# Altium schematic sheet Sheet1.SchDoc
size A4
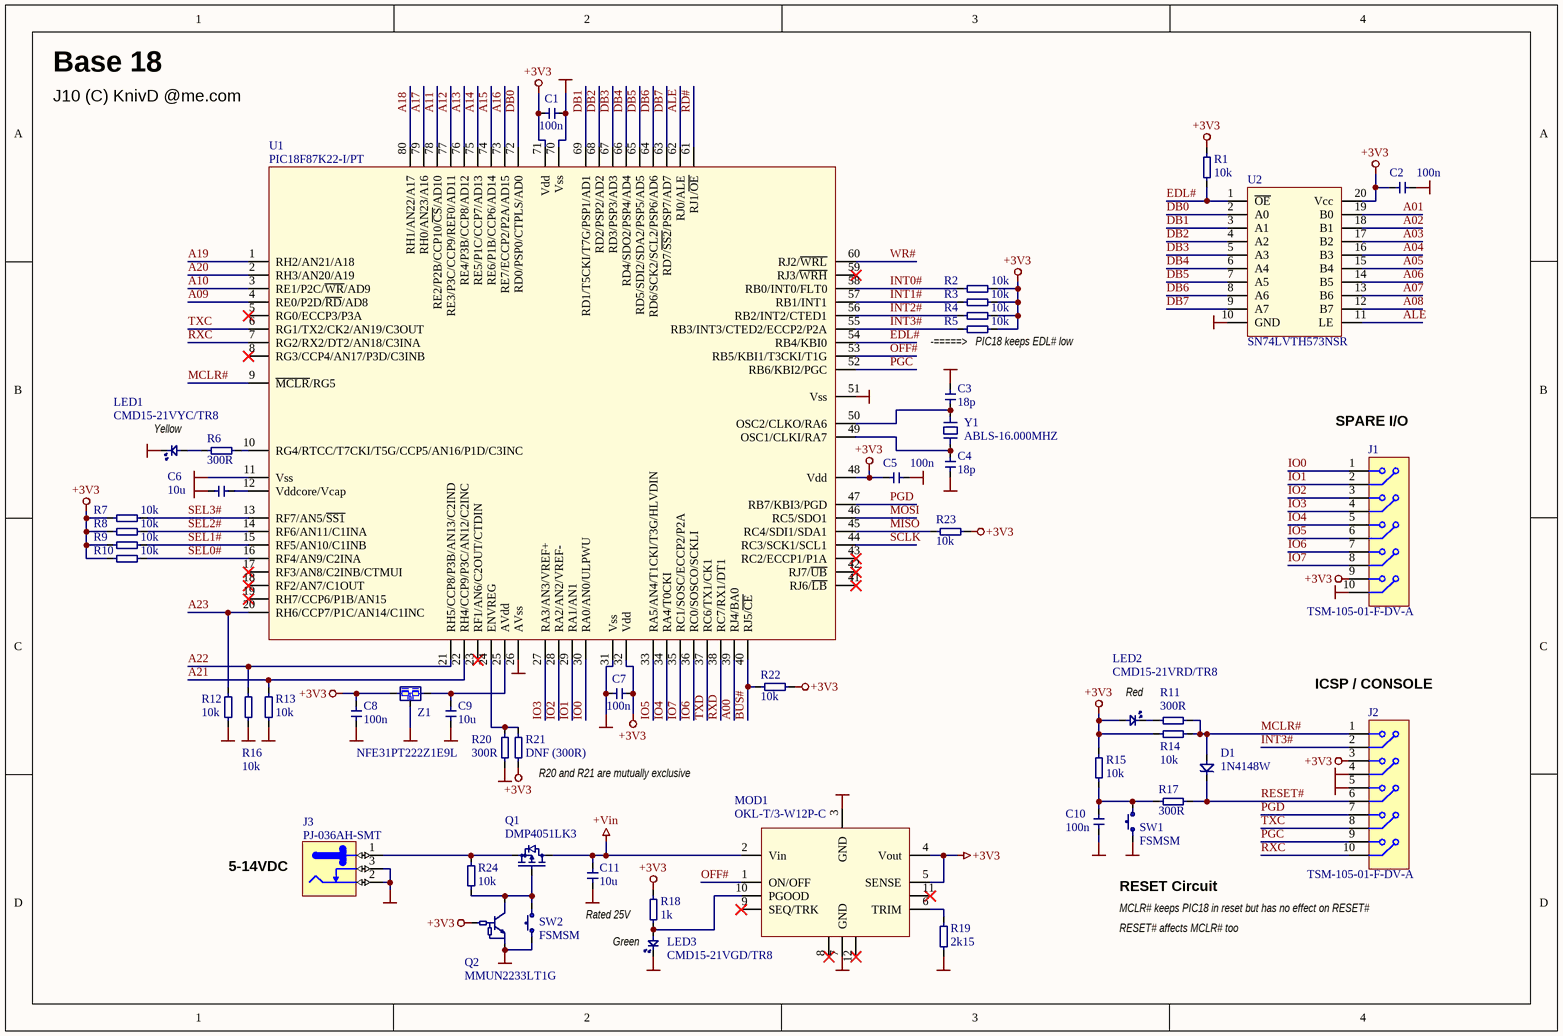
[diagram p0: Sheet1.SchDoc]

## Parts
C1  100n  [CAPC3216X110N]
C2  100n  [CAPC3216X110N]
C3  18p  [CAPC3216X110N]
C4  18p  [CAPC3216X110N]
C5  100n  [CAPC3216X110N]
C6  10u  [CAPC3216X110N]
C7  100n  [CAPC3216X110N]
C8  100n  [CAPC3216X110N]
C9  10u  [CAPC3216X110N]
C10  100n  [CAPC3216X110N]
C11  Note: 10u  [CAPC3216X110N]  (hidden comment: 10u/25V)
D1  1N4148W  [SOD-123]
J1  TSM-105-01-F-DV-A  [2015-2X05XD]
J2  TSM-105-01-F-DV-A  [2015-2X05XD]
J3  PJ-036AH-SMT  [PJ-036AH-SMT]
LED1  CMD15-21VYC/TR8  [LED_OSRAM_LYN971]
LED2  CMD15-21VRD/TR8  [LED_OSRAM_LHN974]
LED3  CMD15-21VGD/TR8  [LED_OSRAM_LGN971]
MOD1  OKL-T/3-W12P-C  [OKL-T/3-W12]
Q1  DMP4051LK3  [TO228P991X239-3N-R546X521]
Q2  MMUN2233LT1G  [SOT23-3]
R1  10k  [RESC3216X75N]
R2  10k  [RESC3216X75N]
R3  10k  [RESC3216X75N]
R4  10k  [RESC3216X75N]
R5  10k  [RESC3216X75N]
R6  300R  [RESC3216X75N]
R7  10k  [RESC3216X75N]
R8  10k  [RESC3216X75N]
R9  10k  [RESC3216X75N]
R10  10k  [RESC3216X75N]
R11  300R  [RESC3216X75N]
R12  10k  [RESC3216X75N]
R13  10k  [RESC3216X75N]
R14  10k  [RESC3216X75N]
R15  10k  [RESC3216X75N]
R16  10k  [RESC3216X75N]
R17  300R  [RESC3216X75N]
R18  1k  [RESC3216X75N]
R19  2k15  [RESC3216X75N]
R20  300R  [RESC3216X75N]
R21  DNF (300R)  [RESC3216X75N]
R22  10k  [RESC3216X75N]
R23  10k  [RESC3216X75N]
R24  10k  [RESC3216X75N]
SW1  FSMSM  [PB_TYCO_FSMSM]
SW2  FSMSM  [PB_TYCO_FSMSM]
U1  PIC18F87K22-I/PT  [QFP50P1400X1400X120-80N]
U2  SN74LVTH573NSR  [SOIC127P780X200-20N]
Y1  ABLS-16.000MHZ  [XTAL1140X470X160N]
Z1  NFE31PT222Z1E9L  [NFE31xx]

## Nets
+3V3: C1.1 C2.1 C5.1 C7.1 C8.1 J1.9 J2.3 LED2.2 MOD1.4(Vout) MOD1.5(SENSE) Q2.1(B) R1.2 R2.1 R3.1 R4.1 R5.1 R7.1 R8.1 R9.1 R10.1 R14.2 R15.2 R18.1 R21.2 R22.1 R23.1 U1.32(Vdd) U1.48(Vdd) U1.71(Vdd) U2.20(Vcc) Z1.1
+Vin: C11.1 MOD1.2(Vin) Q1.3(D)
GND: C1.2 C2.2 C3.2 C4.1 C5.2 C6.2 C7.2 C8.2 C9.2 C10.1 C11.2 J1.10 J2.4 J2.5 J3.2 J3.3 LED1.1 LED3.1 MOD1.3(GND) MOD1.7(GND) Q2.2(E) R12.2 R13.2 R16.2 R19.1 R20.2 SW1.1 SW2.1 U1.11(Vss) U1.26(AVss) U1.31(Vss) U1.51(Vss) U1.70(Vss) U2.10(GND) Z1.2
A00: U1.39(RJ4/BA0)
A01: U2.19(B0)
A02: U2.18(B1)
A03: U2.17(B2)
A04: U2.16(B3)
A05: U2.15(B4)
A06: U2.14(B5)
A07: U2.13(B6)
A08: U2.12(B7)
A09: U1.4(RE0/P2D/~{RD}/AD8)
A10: U1.3(RE1/P2C/~{WR}/AD9)
A11: U1.78(RE2/P2B/CCP10/~{CS}/AD10)
A12: U1.77(RE3/P3C/CCP9/REF0/AD11)
A13: U1.76(RE4/P3B/CCP8/AD12)
A14: U1.75(RE5/P1C/CCP7/AD13)
A15: U1.74(RE6/P1B/CCP6/AD14)
A16: U1.73(RE7/ECCP2/P2A/AD15)
A17: U1.79(RH0/AN23/A16)
A18: U1.80(RH1/AN22/A17)
A19: U1.1(RH2/AN21/A18)
A20: U1.2(RH3/AN20/A19)
A21: R13.1 U1.22(RH4/CCP9/P3C/AN12/C2INC)
A22: R16.1 U1.21(RH5/CCP8/P3B/AN13/C2IND)
A23: R12.1 U1.20(RH6/CCP7/P1C/AN14/C1INC)
ALE: U1.62(RJ0/ALE) U2.11(LE)
BUS#: R22.2 U1.40(RJ5/~{CE})
DB0: U1.72(RD0/PSP0/CTPLS/AD0) U2.2(A0)
DB1: U1.69(RD1/T5CKI/T7G/PSP1/AD1) U2.3(A1)
DB2: U1.68(RD2/PSP2/AD2) U2.4(A2)
DB3: U1.67(RD3/PSP3/AD3) U2.5(A3)
DB4: U1.66(RD4/SDO2/PSP4/AD4) U2.6(A4)
DB5: U1.65(RD5/SDI2/SDA2/PSP5/AD5) U2.7(A5)
DB6: U1.64(RD6/SCK2/SCL2/PSP6/AD6) U2.8(A6)
DB7: U1.63(RD7/~{SS2}/PSP7/AD7) U2.9(A7)
EDL#: R1.1 U1.54(RB4/KBI0) U2.1(~{OE})
INT0#: R2.2 U1.58(RB0/INT0/FLT0)
INT1#: R3.2 U1.57(RB1/INT1)
INT2#: R4.2 U1.56(RB2/INT2/CTED1)
INT3#: J2.2 R5.2 U1.55(RB3/INT3/CTED2/ECCP2/P2A)
IO0: J1.1 U1.30(RA0/AN0/ULPWU)
IO1: J1.2 U1.29(RA1/AN1)
IO2: J1.3 U1.28(RA2/AN2/VREF-)
IO3: J1.4 U1.27(RA3/AN3/VREF+)
IO4: J1.5 U1.34(RA4/T0CKI)
IO5: J1.6 U1.33(RA5/AN4/T1CKI/T3G/HLVDIN)
IO6: J1.7 U1.36(RC0/SOSCO/SCKLI)
IO7: J1.8 U1.35(RC1/SOSC/ECCP2/P2A)
MCLR#: D1.2 J2.1 R11.1 R14.1 U1.9(~{MCLR}/RG5)
MISO: R23.2 U1.45(RC4/SDI1/SDA1)
MOSI: U1.46(RC5/SDO1)
OFF#: MOD1.1(ON/OFF) U1.53(RB5/KBI1/T3CKI/T1G)
PGC: J2.9 U1.52(RB6/KBI2/PGC)
PGD: J2.7 U1.47(RB7/KBI3/PGD)
RD#: U1.61(RJ1/~{OE})
RESET#: D1.1 J2.6 R17.2
RXC: J2.10 U1.7(RG2/RX2/DT2/AN18/C3INA)
RXD: U1.38(RC7/RX1/DT1)
SCLK: U1.44(RC3/SCK1/SCL1)
SEL0#: R10.2 U1.16(RF4/AN9/C2INA)
SEL1#: R9.2 U1.15(RF5/AN10/C1INB)
SEL2#: R8.2 U1.14(RF6/AN11/C1INA)
SEL3#: R7.2 U1.13(RF7/AN5/~{SS1})
TXC: J2.8 U1.6(RG1/TX2/CK2/AN19/C3OUT)
TXD: U1.37(RC6/TX1/CK1)
WR#: U1.60(RJ2/~{WRL})
NetC3_1: C3.1 U1.50(OSC2/CLKO/RA6) Y1.2
NetC4_2: C4.2 U1.49(OSC1/CLKI/RA7) Y1.1
NetC6_1: C6.1 U1.12(Vddcore/Vcap)
NetC9_1: C9.1 U1.25(AVdd) Z1.3
NetC10_2: C10.2 R15.1 R17.1 SW1.2
NetJ3_1: J3.1 Q1.2(S) R24.2
NetLED1_2: LED1.2 R6.1
NetLED2_1: LED2.1 R11.2
NetLED3_2: LED3.2 MOD1.10(PGOOD) R18.2
NetMOD1_6: MOD1.6(TRIM) R19.2
NetQ1_1: Q1.1(G) Q2.3(C) R24.1 SW2.2
NetR6_2: R6.2 U1.10(RG4/RTCC/T7CKI/T5G/CCP5/AN16/P1D/C3INC)
NetR20_1: R20.1 R21.1 U1.24(ENVREG)

Not connected (* = marked no-connect by the designer): MOD1 8* 9(SEQ/TRK)* 11* 12*; U1 5(RG0/ECCP3/P3A)* 8(RG3/CCP4/AN17/P3D/C3INB)* 17(RF3/AN8/C2INB/CTMUI)* 18(RF2/AN7/C1OUT)* 19(RH7/CCP6/P1B/AN15)* 23(RF1/AN6/C2OUT/CTDIN)* 41(RJ6/~{LB})* 42(RJ7/~{UB})* 43(RC2/ECCP1/P1A)* 59(RJ3/~{WRH})*

## Notes on the sheet
- Base 18
- J10 (C) KnivD @me.com
- (near R5) -=====>   PIC18 keeps EDL# low
- Yellow
- (near J1) SPARE I/O
- Red
- (near J2) ICSP / CONSOLE
- R20 and R21 are mutually exclusive
- 5-14VDC
- Rated 25V
- RESET Circuit
- MCLR# keeps PIC18 in reset but has no effect on RESET#
- Green
- RESET# affects MCLR# too

## Library data of the parts
C1-C11 = Capacitor
D1 = Diode Schottky: Schottky diode
J1 J2 = Connector 2x5: Dual row, 10-way connector
J3 = LUMBERG_161314: 2.1/5.5mm barrel power jack, SMT; Component Kind: Standard; Component Type: Standard; ComponentHeight: 11mm; Author: CERN DEM JLC
LED1-LED3 = LED: Light Emitting Diode
MOD1 = OKL-T/3-W12: Programmable Output 3-Amp iLGA SMT PoLs; Manufacturer: Murata
Q1 = P-FET: P-channel FET transistor
Q2 = NPN BIASED: NPN biased bipolar transistor
R1-R24 = Resistor
SW1 SW2 = Switch MNO SPST: Switch, Momentary, Normal Open
U1 = PIC18F87K22: High-Performance, 1-Mbit Enhanced Flash MCUs  with 12-Bit A/D and XLP Technology; Manufacturer: Microchip; Packages: I/PT (TQFP80-12x12mm); I/MR (QFN80-9x9mm)
U2 = 74xxx373: A Octal Transparent D-Type Latches With 3-State Outputs
Y1 = Crystal: Crystal Resonator
Z1 = Filter: Hybrid filter